# Altium schematic sheet acDetector.SchDoc
size A
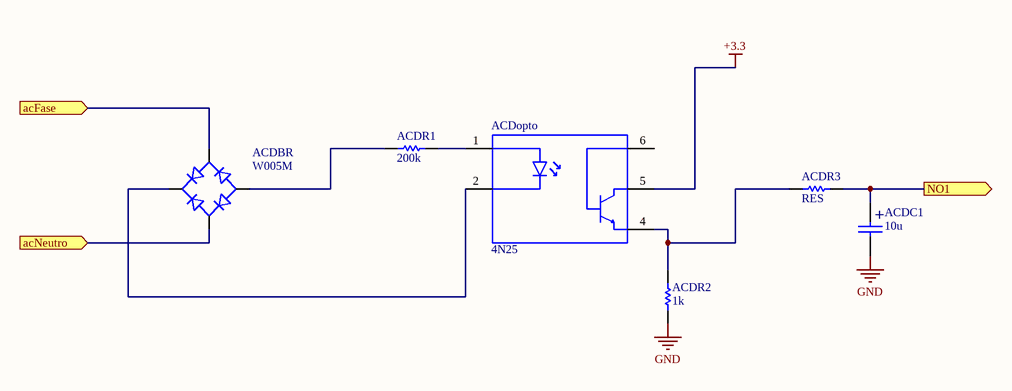
[diagram p0: acDetector.SchDoc]

## Parts
ACDBR  W005M  [DIOB_W005M]
ACDC1  10u  [CAP100RP]
ACDopto  4N25  [DIP6]
ACDR1  200k  [RES400]
ACDR2  1k  [RES400]
ACDR3  RES  [RES400]

## Ports
acFase (in), acNeutro (in), NO1 (out)

## Nets
+3.3: ACDopto.5(C)
GND: ACDC1.2 ACDR2.1
acFase: ACDBR.2(AC1) ; port acFase
acNeutro: ACDBR.4(AC2) ; port acNeutro
NO1: ACDC1.1 ACDR3.2 ; port NO1
NetACDBR_1: ACDBR.1(POS) ACDopto.2(K)
NetACDBR_3: ACDBR.3(NEG) ACDR1.1
NetACDopto_1: ACDopto.1(A) ACDR1.2
NetACDopto_4: ACDopto.4(E) ACDR2.2 ACDR3.1

Not connected (* = marked no-connect by the designer): ACDopto 6(B)

## Notes on the sheet
- (in symbol CAPPOL) +

## Library data of the parts
ACDBR = W005M: Bridge Rectifier Single Phase Standard 50V Through Hole WOM; MF: GeneSiC Semiconductor; Value: *; Availability: Unavailable; Price: None; MP: W005M; Package: 4-4 Rectron; SnapEDA_Link: https://www.snapeda.com/parts/W005M/GeneSiC%20Semiconductor/view-part/1824904/?ref=snap
ACDC1 = CAPPOL
ACDopto = 4N25: Optoisolator Transistor with Base Output 5000Vrms 1 Channel 6-DIP; MF: Vishay Semiconductor; Package: DIP-6 Lite-On; Value: *; Price: None; MP: 4N25; SnapEDA_Link: https://www.snapeda.com/parts/4N25/Vishay%20Semiconductor%20Opto%20Division/view-part/641454/?ref=snap; Availability: Unavailable
ACDR1 ACDR2 = RES